# EAGLE design PowerModule (EAGLE 7.4.0)
CNAME: UBEC; CREVISION: 1.0; DESIGNER: Ye Wang
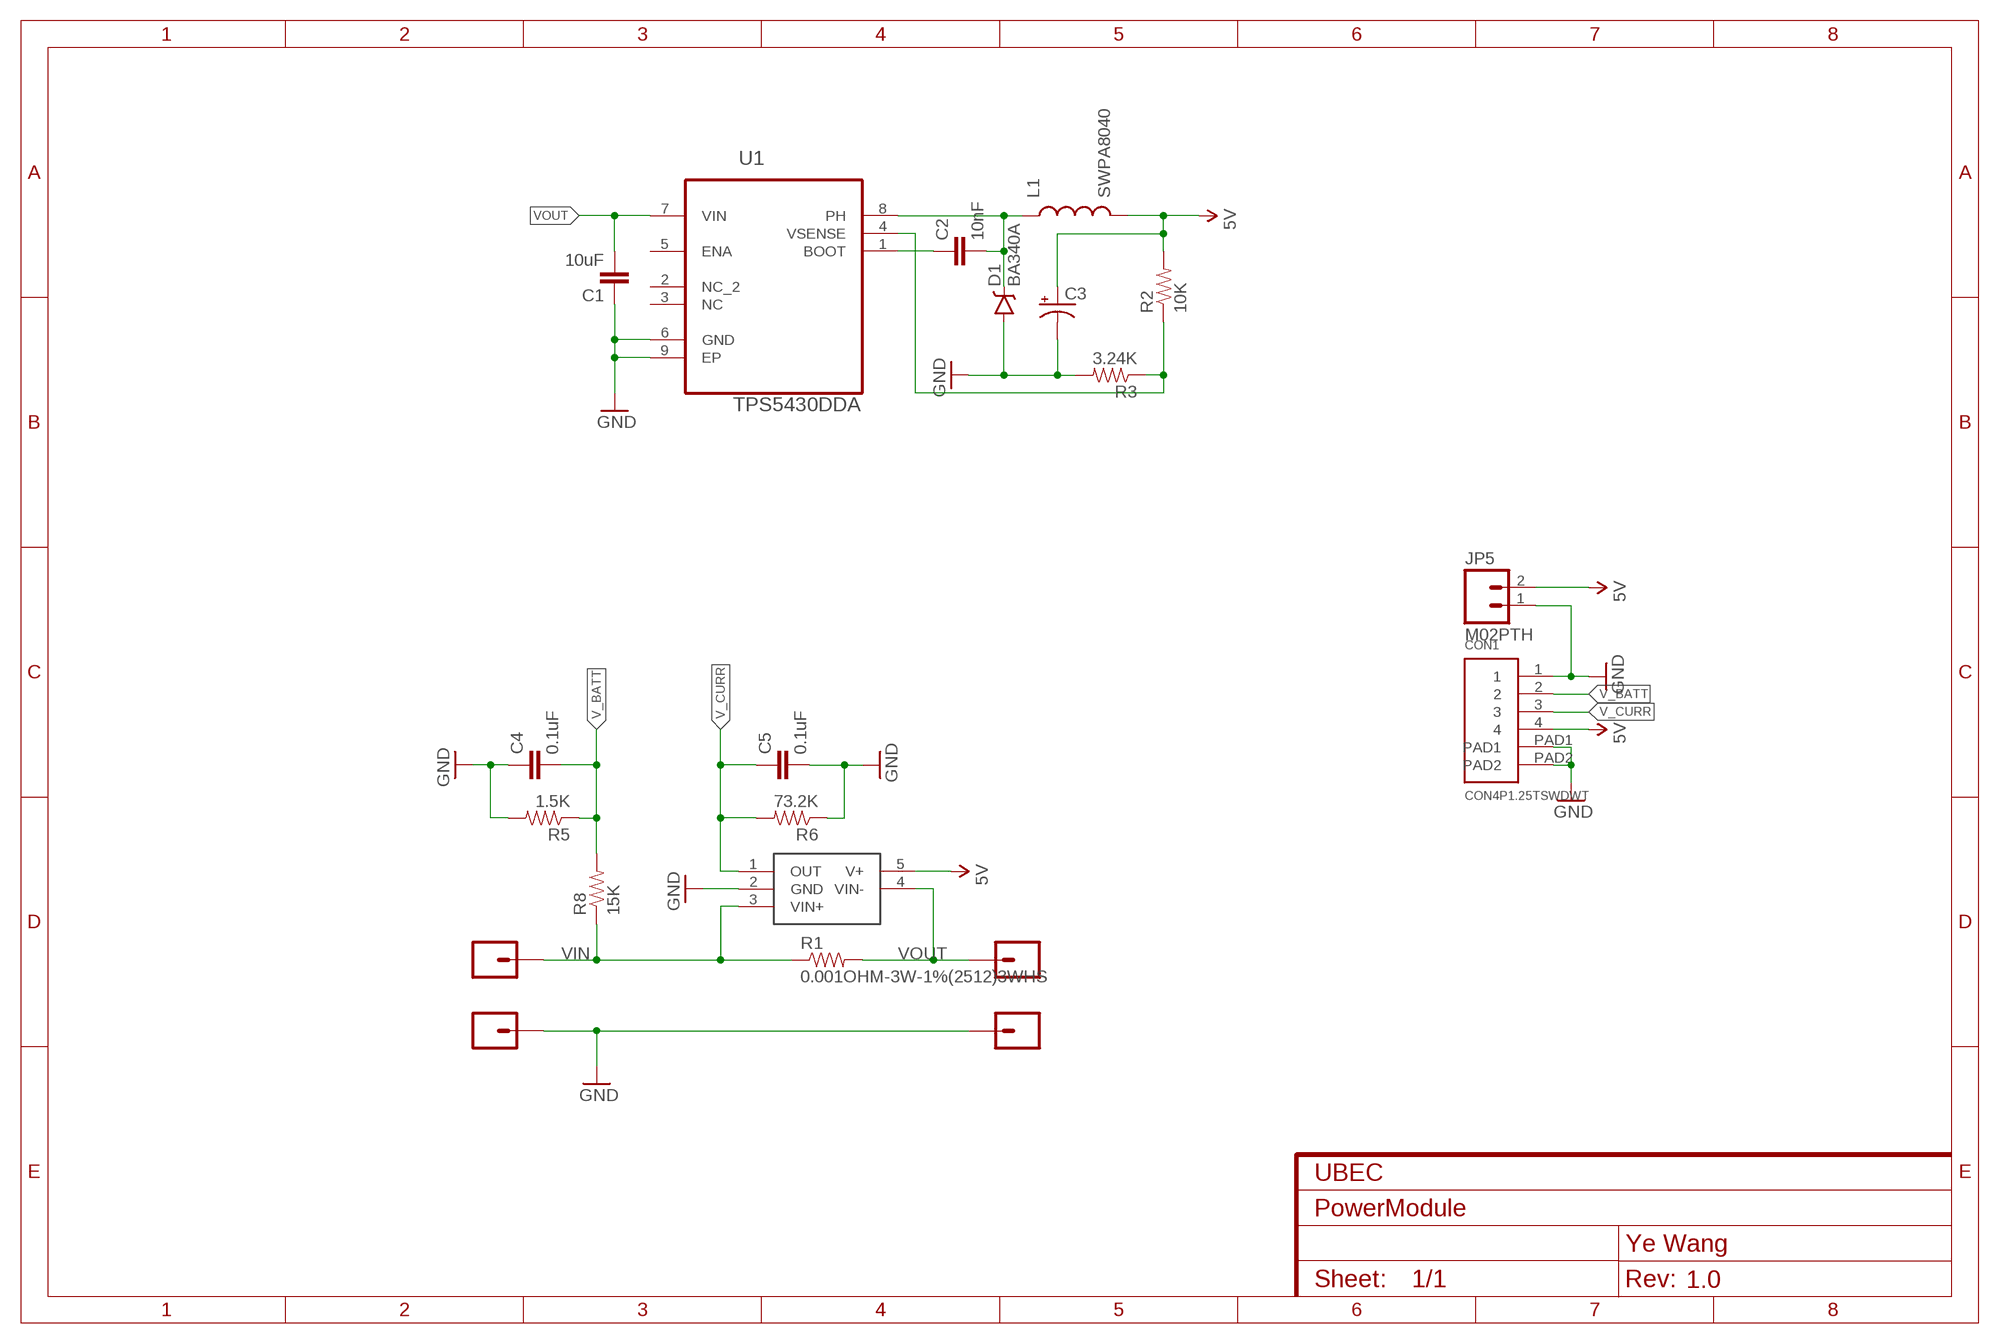
[diagram p0: schematic, sheet 1]

## Parts
C1  10uF  CAP1206  [1206]
C2  10nF  10NF/10000PF-50V-10%(0603)  [0603-CAP]
C3  CAP_POLD  [PANASONIC_D]
C4  0.1uF  0.1UF-25V-5%(0603)  [0603-CAP]
C5  0.1uF  0.1UF-25V-5%(0603)  [0603-CAP]
CON1  CON4P1.25TSWDWT  [1.25T4P]
D1  BA340A  B340A  [SMA-DIODE]
JP1  M016.5X5.5  [1PAD]
JP2  M016.5X5.5  [1PAD]
JP3  M016.5X5.5  [1PAD]
JP4  M016.5X5.5  [1PAD]
JP5  M02PTH  [1X02]
L1  SWPA8040  [INC8040]
R1  0.001OHM-3W-1%(2512)3WHS  [R2512W]
R2  10K  10KOHM-1/10W-1%(0603)0603  [0603-RES]
R3  3.24K  RESISTOR0603-RES  [0603-RES]
R5  1.5K  1.5KOHM-1/10W-1%(0603)  [0603]
R6  73.2K  RESISTOR0603-RES  [0603-RES]
R8  15K  15KOHM1/10W1%(0603)0603  [0603-RES]
U1  TPS5430DDA  [SOIC127P600X170-9N]
U$1  INA169  [SOT23-5]

## Nets
5V: C3.+ CON1.4 JP5.2 L1.2 R2.2 U$1.5(V+)
GND: C1.1 C3.- C4.1 C5.2 CON1.1 CON1.PAD1 CON1.PAD2 D1.A JP3.1 JP4.1 JP5.1 R3.2 R5.2 R6.1 U1.6(GND) U1.9(EP) U$1.2(GND)
INCT: C2.2 D1.C L1.1 U1.8(PH)
N$1: C2.1 U1.1(BOOT)
N$4: R2.1 R3.1 U1.4(VSENSE)
V_BATT: C4.2 CON1.2 R5.1 R8.2
V_CURR: C5.1 CON1.3 R6.2 U$1.1(OUT)
VIN: JP1.1 R1.1 R8.1 U$1.3(VIN+)
VOUT: C1.2 JP2.1 R1.2 U1.7(VIN) U$1.4(VIN-)
Unconnected: U1.2(NC_2) U1.3(NC) U1.5(ENA)

## Library data of the parts
C1 = SparkFun-Capacitors:CAP: Capacitor Standard 0603 ceramic capacitor, and 0.1" leaded capacitor.
C2 = SparkFun-Capacitors:10NF/10000PF-50V-10%(0603): CAP-00867; PROD_ID: CAP-00867
C3 = SparkFun-Capacitors:CAP_POL: Capacitor Polarized These are standard SMD and PTH capacitors. Normally 10uF, 47uF, and 100uF in electrolytic and tantalum varieties. Always verify the external diameter of the through hole cap, it varies with capacity, voltage, and manufacturer. The EIA devices should be standard.
C4 C5 = SparkFun-Capacitors:0.1UF-25V-5%(0603): CAP-08604; PROD_ID: CAP-08604
CON1 = szjlc:CON4P
D1 = SparkFun-DiscreteSemi:B340A: Schottky Diode 3A-40V; PROD_ID: DIO-09886
JP1-JP4 = SparkFun-Connectors:M01: Header 1 Standard 1-pin 0.1" header. Use with straight break away headers (SKU : PRT-00116), right angle break away headers (PRT-00553), swiss pins (PRT-00743), machine pins (PRT-00117), and female headers (PRT-00115).
JP5 = SparkFun-Connectors:M02: Standard 2-pin 0.1" header. Use with - straight break away headers ( PRT-00116) - right angle break away headers (PRT-00553) - swiss pins (PRT-00743) - machine pins (PRT-00117) - female headers (PRT-00115) Molex polarized connector foot print use with: PRT-08233 with associated crimp pins and housings. 2.54_SCREWTERM for use with PRT-10571. 3.5mm Screw Terminal footprints for PRT-08084 5mm Screw Terminal footprints for use with PRT-08432
L1 = inductor:SWPA
R1 = SparkFun-Resistors:0.001OHM-3W-1%(2512)
R2 = SparkFun-Resistors:10KOHM-1/10W-1%(0603): RES-00824; PROD_ID: RES-00824
R3 R6 = SparkFun-Resistors:RESISTOR: Resistor Basic schematic elements and footprints for 0603, 1206, and PTH resistors.
R5 = SparkFun-Resistors:1.5KOHM-1/10W-1%(0603): RES-08306; PROD_ID: RES-08306; VALUE: 1.5KOHM
R8 = SparkFun-Resistors:15KOHM1/10W1%(0603): RES-07854; PROD_ID: RES-07854
U1 = ti_misc:TPS5430DDA: 3-A, WIDE INPUT RANGE, STEP-DOWN SWIFT CONVERTER; MPN: TPS5430DDA; OC_FARNELL: -; OC_NEWARK: 75K1619; PACKAGE: SOIC-8; SUPPLIER: Texas Instruments
U$1 = SparkFun-Misc:INA169

## Board
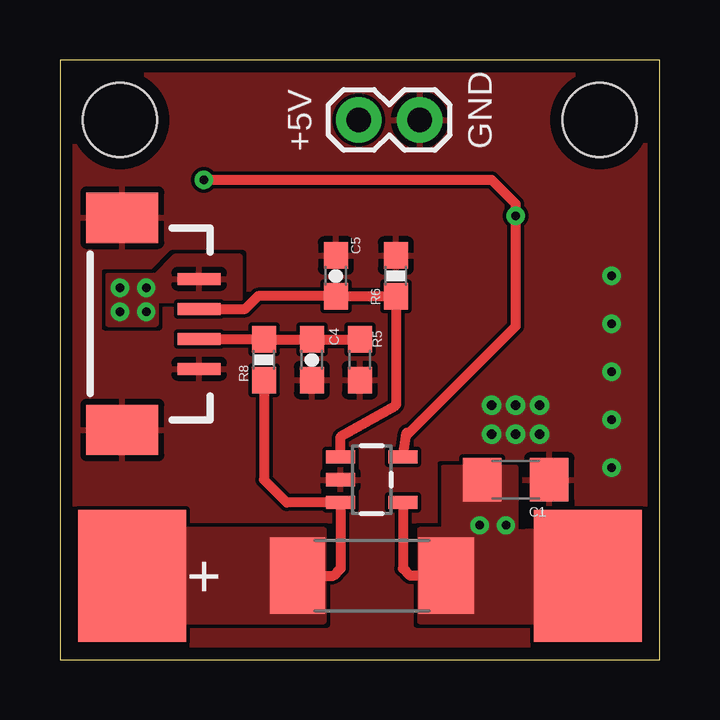
[diagram p1: board, top side]
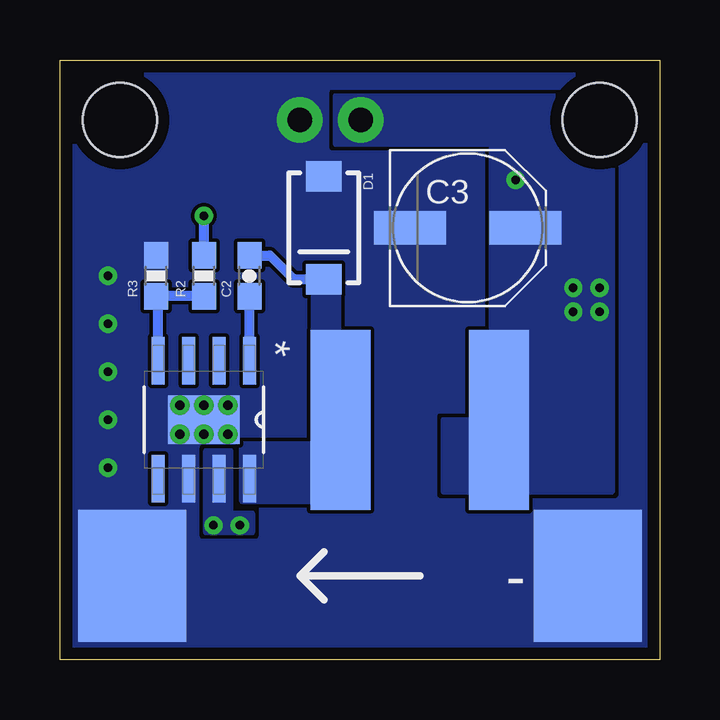
[diagram p2: board, bottom side, seen from below]

Size 25 x 25 mm. Coordinates in mm from the lower left corner, seen from the top.
Outline: 0,0 25,0 25,25 0,25 0,0
Copper layers (1*16): Top 0.035mm / dielectric 1.5mm / Bottom 0.035mm
Design rules "default *": minimum track width 8mil, minimum drill 0.3mm, track to track 6mil, track to pad 6mil, pad to pad 6mil, via to via 6mil, smd to smd 6mil, copper to edge 20mil, drill to drill 6mil, minimum pad ring 10mil, minimum via ring 8mil, stop-mask expansion 4mil, vias tented up to drill 0.36mm, thermal gap 10mil
Holes 3.1 mm at 22.5,22.5 2.5,22.5

### Footprints (pad centres in the part's own frame; a part is rotated, then mirrored left to right if it is on the bottom)
1206 = smd 1.6 x 1.8: 1 -1.4,0; 2 1.4,0
0603-CAP = smd 1.1 x 1: 1 -0.85,0; 2 0.85,0
PANASONIC_D = smd 3 x 1.4: + 2.4,0; - -2.4,0
1.25T4P = smd 0.5 x 1.8: 1 -1.875,-1.8; 2 -0.625,-1.8; 3 0.625,-1.8; 4 1.875,-1.8 | smd 2.1 x 3: PAD1 -4.425,1.4; PAD2 4.425,1.4
SMA-DIODE = smd 1.27 x 1.47: A -2.15,0; C 2.15,0
1PAD = smd 5.5 x 4.5: 1 0,0
1X02 = drill 1.016 pad 1.88: 1 0,0; 2 2.54,0
INC8040 = smd 2.5 x 7.5: 1 -3.3,0; 2 3.3,0
R2512W = smd 2.3 x 3.2: 1 -3.1,0; 2 3.1,0
0603-RES = smd 1.1 x 1: 1 -0.85,0; 2 0.85,0
0603 = smd 1.1 x 1: 1 -0.85,0; 2 0.85,0
SOIC127P600X170-9N = smd 1.981 x 0.559: 1 -2.464,1.905; 2 -2.464,0.635; 3 -2.464,-0.635; 4 -2.464,-1.905; 5 2.464,-1.905; 6 2.464,-0.635; 7 2.464,0.635; 8 2.464,1.905 | smd 2.007 x 2.997: 9 0,0
SOT23-5 = smd 0.55 x 1.2: 1 -0.95,-1.3; 2 0,-1.3; 3 0.95,-1.3; 4 0.95,1.3; 5 -0.95,1.3

### Placement (x,y rotation side)
C1  19,7.5 180 top
C2  17.09,16 90 bottom
C3  8,18 0 bottom
C4  10.5,12.5 90 top
C5  11.5,16 90 top
CON1  4,14 90 top
D1  14,18 270 bottom
JP1  3,3.5 270 top
JP2  22,3.5 90 top
JP3  22,3.5 270 bottom
JP4  3,3.5 270 bottom
JP5  15,22.5 180 top
L1  10,10 0 bottom
R1  13,3.5 0 top
R2  19,16 90 bottom
R3  21,16 90 bottom
R5  12.5,12.5 270 top
R6  14,16 270 top
R8  8.5,12.5 90 top
U1  19,10 270 bottom
U$1  13,7.5 270 top

### Tracks (layer width: path | path; a pad name or v marks a point on that pad's centre or on a via)
5V  (via drill 0.35)
  Top 0.406: v6,20 18,20 19,19 v19,18.5 19,13.9 14.45,9.35 14.45,9.45 U$1.5
  Bottom 0.406: R2.2 v19,18.5
  other vias: 2.5,14.5 2.5,15.5 3.6,15.5 3.6,14.5
  pour Bottom (no thermals): 9,7 9,10 7,10 7,21.5 13.5,21.5 13.5,23.5 2,23.5 2,7
  pour Top: 2,14 4,14 4,15 7.5,15 7.5,16.8 4.8,16.8 4,16 2,16
GND  (via drill 0.35, 0.4)
  other vias: 18,9.4 23,8 20,9.4 20,10.6 18,10.6 23,10 23,12 23,14 23,16 19,10.6 19,9.4
  pour Top (rank 2): 0,0 25,0 25,25 0,25
  pour Bottom (rank 2, no thermals): 0,0 25,0 25,25 0,25
INCT
  Bottom 0.406: D1.C 15.25,15.85 16.25,16.85 C2.2
  pour Bottom (no thermals): 17.4,6.6 17.4,9 14.4,9 14.4,16.3 13.4,16.3 13.4,13.6 12.4,13.6 12.4,6.6
N$1
  Bottom 0.406: U1.1 C2.1
N$4
  Bottom 0.406: R2.1 R3.1 20.91,15.05 U1.4
V_BATT
  Top 0.406: CON1.2 8.47,13.38 R8.2 C4.2 R5.1
V_CURR
  Top 0.406: CON1.3 7.72,14.62 8.25,15.15 C5.1 R6.2 14,10.6 11.7,9.3 U$1.1
VIN
  Top 0.406: R1.1 11.4,3.5 11.7,3.8 U$1.3 9.45,6.55 8.5,7.5 R8.1
  pour Top (no thermals): 11,1.6 11,5.4 4,5.4 4,1.6
VOUT  (via drill 0.35)
  Top 0.406: R1.2 14.6,3.5 14.3,3.8 U$1.4
  other vias: 17.5,5.6 18.6,5.6
  pour Top (no thermals): 15,1.6 21,1.6 21,5.4 19,5.3 19,8 16,8 16,5.4 15,5.4
  pour Bottom (no thermals): 18.9,5.3 18.9,8.7 17.9,8.7 17.9,6.1 17,6.1 17,5.3

### Text on the board
tPlace: +5V | GND | +
bPlace: -